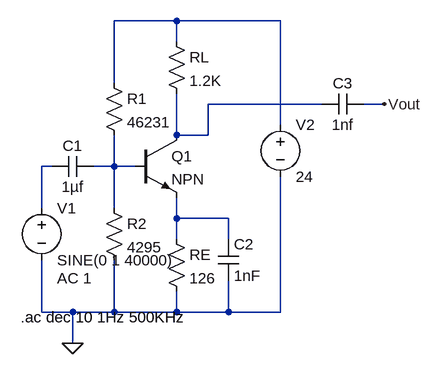
[diagram p0: schematic CommonEmitterAmp2.asc]
CommonEmitterAmp2.asc, the LTspice schematic file:
Version 4
SHEET 1 880 680
WIRE 48 32 -48 32
WIRE 208 32 48 32
WIRE 48 64 48 32
WIRE -48 128 -48 32
WIRE 272 160 96 160
WIRE 368 160 336 160
WIRE 208 192 208 32
WIRE 48 208 48 144
WIRE 96 208 96 160
WIRE 96 208 48 208
WIRE -144 256 -160 256
WIRE -48 256 -48 208
WIRE -48 256 -80 256
WIRE -16 256 -48 256
WIRE -160 320 -160 256
WIRE -48 320 -48 256
WIRE 48 336 48 304
WIRE 128 336 48 336
WIRE 48 368 48 336
WIRE 128 368 128 336
WIRE -160 480 -160 400
WIRE -112 480 -160 480
WIRE -48 480 -48 400
WIRE -48 480 -112 480
WIRE 48 480 48 448
WIRE 48 480 -48 480
WIRE 128 480 128 432
WIRE 128 480 48 480
WIRE 208 480 208 272
WIRE 208 480 128 480
WIRE -112 528 -112 480
FLAG -112 528 0
FLAG 368 160 Vout
SYMBOL npn -16 208 R0
SYMATTR InstName Q1
SYMBOL res 32 352 R0
SYMATTR InstName RE
SYMATTR Value 126
SYMBOL cap 112 368 R0
SYMATTR InstName C2
SYMATTR Value 1nF
SYMBOL voltage -160 304 R0
WINDOW 123 24 124 Left 2
WINDOW 39 0 0 Left 0
SYMATTR Value2 AC 1
SYMATTR InstName V1
SYMATTR Value SINE(0 1 40000)
SYMBOL res -64 112 R0
SYMATTR InstName R1
SYMATTR Value 46231
SYMBOL res 32 48 R0
SYMATTR InstName RL
SYMATTR Value 1.2K
SYMBOL voltage 208 176 R0
WINDOW 123 24 124 Left 2
WINDOW 39 0 0 Left 0
SYMATTR InstName V2
SYMATTR Value 24
SYMBOL cap -80 240 R90
WINDOW 0 0 32 VBottom 2
WINDOW 3 32 32 VTop 2
SYMATTR InstName C1
SYMATTR Value 1µf
SYMBOL cap 336 144 R90
WINDOW 0 0 32 VBottom 2
WINDOW 3 32 32 VTop 2
SYMATTR InstName C3
SYMATTR Value 1nf
SYMBOL res -64 304 R0
SYMATTR InstName R2
SYMATTR Value 4295
TEXT -192 488 Left 2 !.ac dec 10 1Hz 500KHz

The netlist it stands for:
* CommonEmitterAmp2.asc
Q1 N002 N004 N005 0 NPN
RE N005 0 126
C2 N005 0 1nF
V1 N003 0 SINE(0 1 40000) AC 1
R1 N001 N004 46231
RL N001 N002 1.2K
V2 N001 0 24
C1 N004 N003 1µf
C3 Vout N002 1nf
R2 N004 0 4295
.model NPN NPN
.model PNP PNP
.lib standard.bjt
.ac dec 10 1Hz 500KHz
.backanno
.end